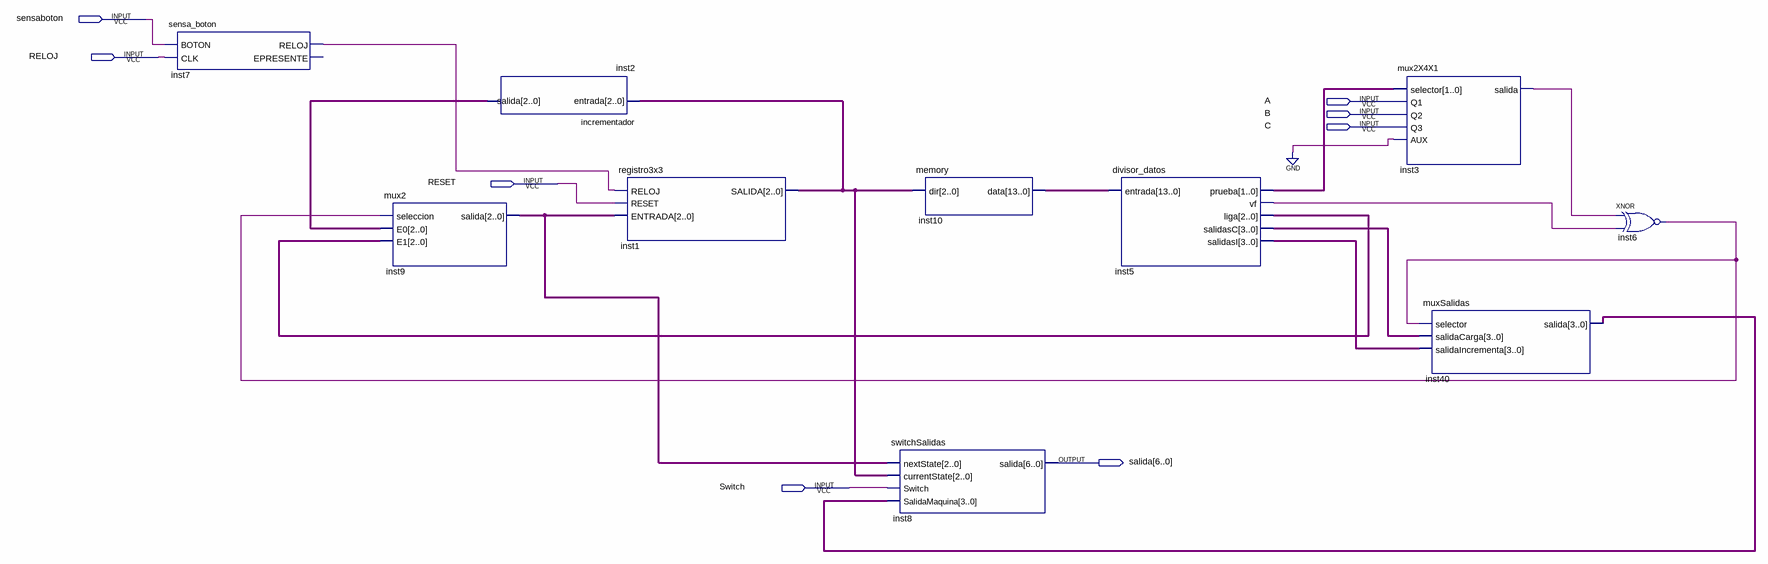
[diagram p0: schematic sheet]
// Quartus schematic LOAC_P5.bdf as structural Verilog: 10 symbols, 8 pins
module LOAC_P5 (
  input  sensaboton,
  input  RELOJ,
  input  A,
  input  B,
  input  C,
  input  RESET,
  input  Switch,
  output [6:0] salida
);

  wire inst3_salida, inst5_vf, inst6_out, inst7_reloj;
  wire [1:0] inst5_prueba;
  wire [2:0] inst1_salida, inst2_salida, inst5_liga, inst9_salida;
  wire [3:0] inst5_salidasc, inst5_salidasi, inst40_salida;
  wire [13:0] inst10_data;

  sensa_boton inst7 (.BOTON(sensaboton), .CLK(RELOJ), .RELOJ(inst7_reloj));  // open: EPRESENTE
  mux2 inst9 (.seleccion(inst6_out), .E0(inst2_salida), .E1(inst5_liga), .salida(inst9_salida));
  incrementador inst2 (.entrada(inst1_salida), .salida(inst2_salida));
  registro3x3 inst1 (.RELOJ(inst7_reloj), .RESET(RESET), .ENTRADA(inst9_salida), .SALIDA(inst1_salida));
  memory inst10 (.dir(inst1_salida), .data(inst10_data));
  switchSalidas inst8 (
    .nextState(inst9_salida), .currentState(inst1_salida), .Switch(Switch), .SalidaMaquina(inst40_salida),
    .salida(salida));
  divisor_datos inst5 (
    .entrada(inst10_data), .prueba(inst5_prueba), .vf(inst5_vf), .liga(inst5_liga),
    .salidasC(inst5_salidasc), .salidasI(inst5_salidasi));
  mux2X4X1 inst3 (.selector(inst5_prueba), .Q1(A), .Q2(B), .Q3(C), .AUX(1'b0), .salida(inst3_salida));
  muxSalidas inst40 (
    .selector(inst6_out), .salidaCarga(inst5_salidasc), .salidaIncrementa(inst5_salidasi),
    .salida(inst40_salida));
  xnor inst6 (inst6_out, inst3_salida, inst5_vf);
endmodule
